# EAGLE schematic lupa-carrier (EAGLE 8.3.1)

## Sheet 1 of 2: Headers
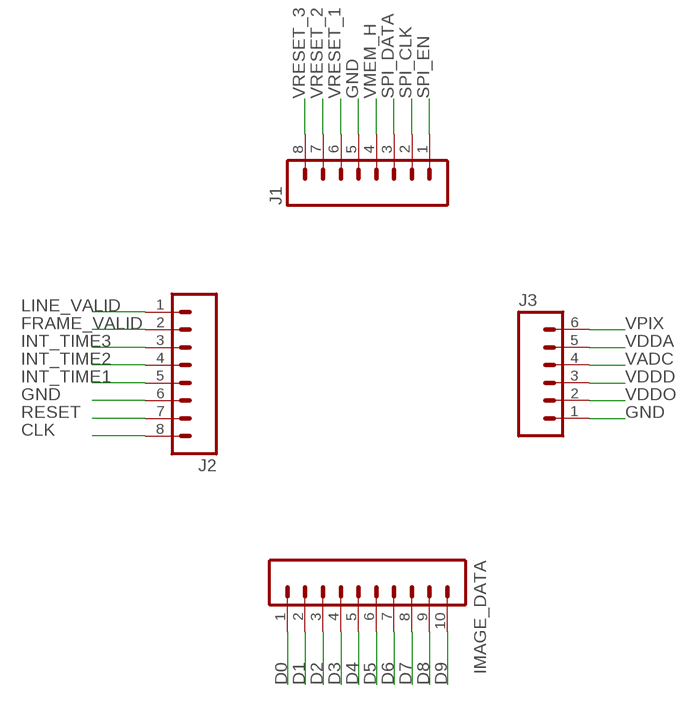
[diagram p0: schematic, sheet 1]

### Parts
IMAGE_DATA  M10SILK_FEMALE_PTH  [1X10]
J1  M08  [1X08_ROUND]
J2  M08  [1X08_ROUND]
J3  M06SILK_FEMALE_PTH  [1X06]

### Nets
CLK: J2.8
D0: IMAGE_DATA.1
D1: IMAGE_DATA.2
D2: IMAGE_DATA.3
D3: IMAGE_DATA.4
D4: IMAGE_DATA.5
D5: IMAGE_DATA.6
D6: IMAGE_DATA.7
D7: IMAGE_DATA.8
D8: IMAGE_DATA.9
D9: IMAGE_DATA.10
FRAME_VALID: J2.2
GND: J1.5 J2.6 J3.1 ; also sheet 2
INT_TIME1: J2.5
INT_TIME2: J2.4
INT_TIME3: J2.3
LINE_VALID: J2.1
RESET: J2.7
SPI_CLK: J1.2
SPI_DATA: J1.3
SPI_EN: J1.1
VADC: J3.4 ; also sheet 2
VDDA: J3.5 ; also sheet 2
VDDD: J3.3 ; also sheet 2
VDDO: J3.2 ; also sheet 2
VMEM_H: J1.4 ; also sheet 2
VPIX: J3.6 ; also sheet 2
VRESET_1: J1.6 ; also sheet 2
VRESET_2: J1.7
VRESET_3: J1.8

## Sheet 2 of 2: Regulators
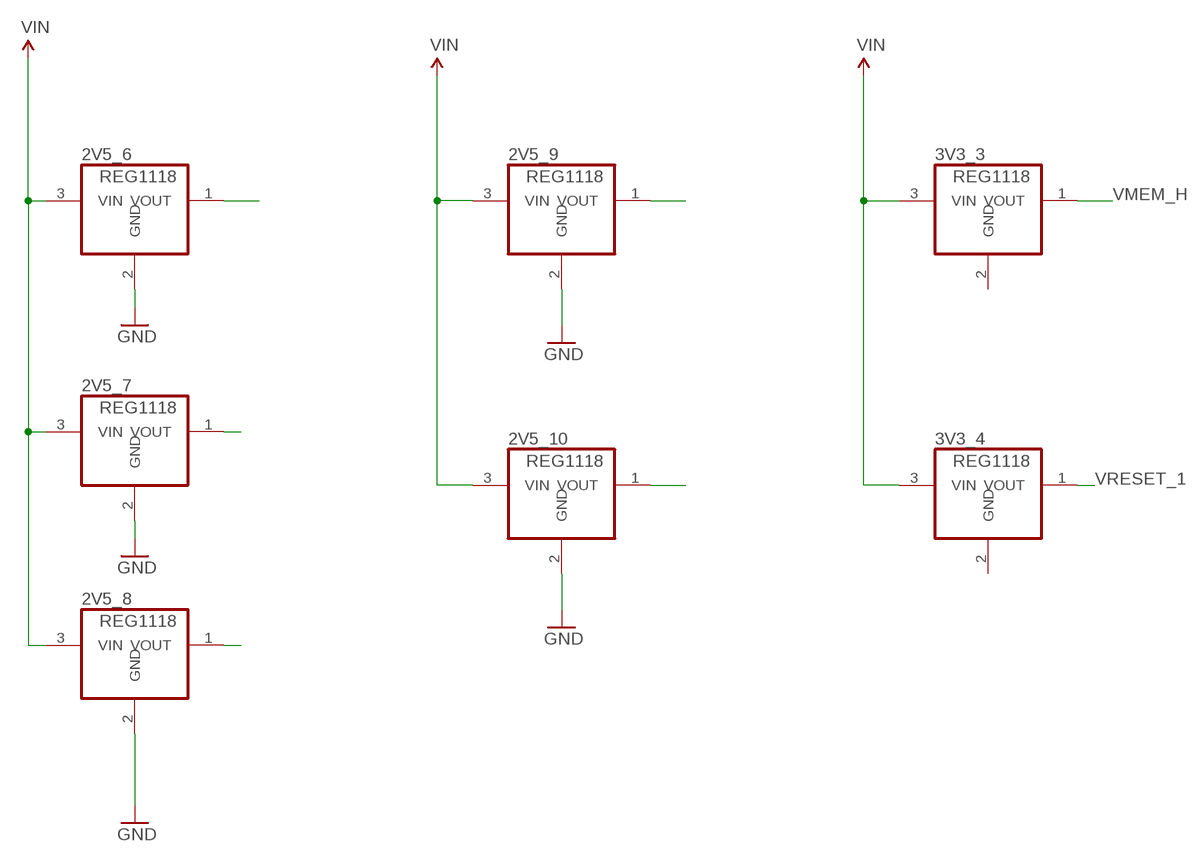
[diagram p1: schematic, sheet 2]

### Parts
2V5_6  REG1118  [SOT223]
2V5_7  REG1118  [SOT223]
2V5_8  REG1118  [SOT223]
2V5_9  REG1118  [SOT223]
2V5_10  REG1118  [SOT223]
3V3_3  REG1118  [SOT223]
3V3_4  REG1118  [SOT223]

### Nets
GND: 2V5_6.2(GND) 2V5_7.2(GND) 2V5_8.2(GND) 2V5_9.2(GND) 2V5_10.2(GND) ; also sheet 1
VADC: 2V5_8.1(VOUT) ; also sheet 1
VDDA: 2V5_7.1(VOUT) ; also sheet 1
VDDD: 2V5_9.1(VOUT) ; also sheet 1
VDDO: 2V5_10.1(VOUT) ; also sheet 1
VIN: 2V5_6.3(VIN) 2V5_7.3(VIN) 2V5_8.3(VIN) 2V5_9.3(VIN) 2V5_10.3(VIN) 3V3_3.3(VIN) 3V3_4.3(VIN)
VMEM_H: 3V3_3.1(VOUT) ; also sheet 1
VPIX: 2V5_6.1(VOUT) ; also sheet 1
VRESET_1: 3V3_4.1(VOUT) ; also sheet 1

## Power pins joined to a net without a drawn wire
GND: 3V3_3.2(GND) 3V3_4.2(GND)

## Library data of the parts
2V5_6-2V5_10 3V3_3 3V3_4 = burr-brown:REG1118: 800mA Low Dropout (LDO) Positive Regulator with Current Source and Sink Capability; MPN: REG1118-2.85/2K5G4; OC_FARNELL: unknown; OC_NEWARK: 14M2185
IMAGE_DATA = SparkFun-Connectors:M10: Header 10 Standard 10-pin 0.1" header. Use with straight break away headers (SKU : PRT-00116), right angle break away headers (PRT-00553), swiss pins (PRT-00743), machine pins (PRT-00117), and female headers (PRT-00115).; PROD_ID: CONN-11563
J1 J2 = SparkFun-Connectors:M08: Header 8 Standard 8-pin 0.1" header. Use with straight break away headers (SKU : PRT-00116), right angle break away headers (PRT-00553), swiss pins (PRT-00743), machine pins (PRT-00117), and female headers (PRT-00115).; PROD_ID: CONN-08437
J3 = SparkFun-Connectors:M06: Header 6 Standard 6-pin 0.1" header. Use with straight break away headers (SKU : PRT-00116), right angle break away headers (PRT-00553), swiss pins (PRT-00743), machine pins (PRT-00117), and female headers (PRT-00115). Molex polarized connector foot print use with SKU : PRT-08094 with associated crimp pins and housings. NOTES ON THE VARIANTS LOCK and LOCK_LONGPADS... This footprint was designed to help hold the alignment of a through-hole component (i.e. 6-pin header) while soldering it into place. You may notice that each hole has been shifted either up or down by 0.005 of an inch from it's more standard position (which is a perfectly straight line). This slight alteration caused the pins (the squares in the middle) to touch the edges of the holes. Because they are alternating, it causes a "brace" to hold the component in place. 0.005 has proven to be the perfect amount of "off-center" position when using our standard breakaway headers. Although looks a little odd when you look at the bare footprint, once you have a header in there, the alteration is very hard to notice. Also,if you push a header all the way into place, it is covered up entirely on the bottom side. This idea of altering the position of holes to aid alignment will be further integrated into the Sparkfun Library for other footprints. It can help hold any component with 3 or more connection pins.; PROD_ID: CONN-08437